# EAGLE design MySens-easyESP32-012 (EAGLE 9.0.1)
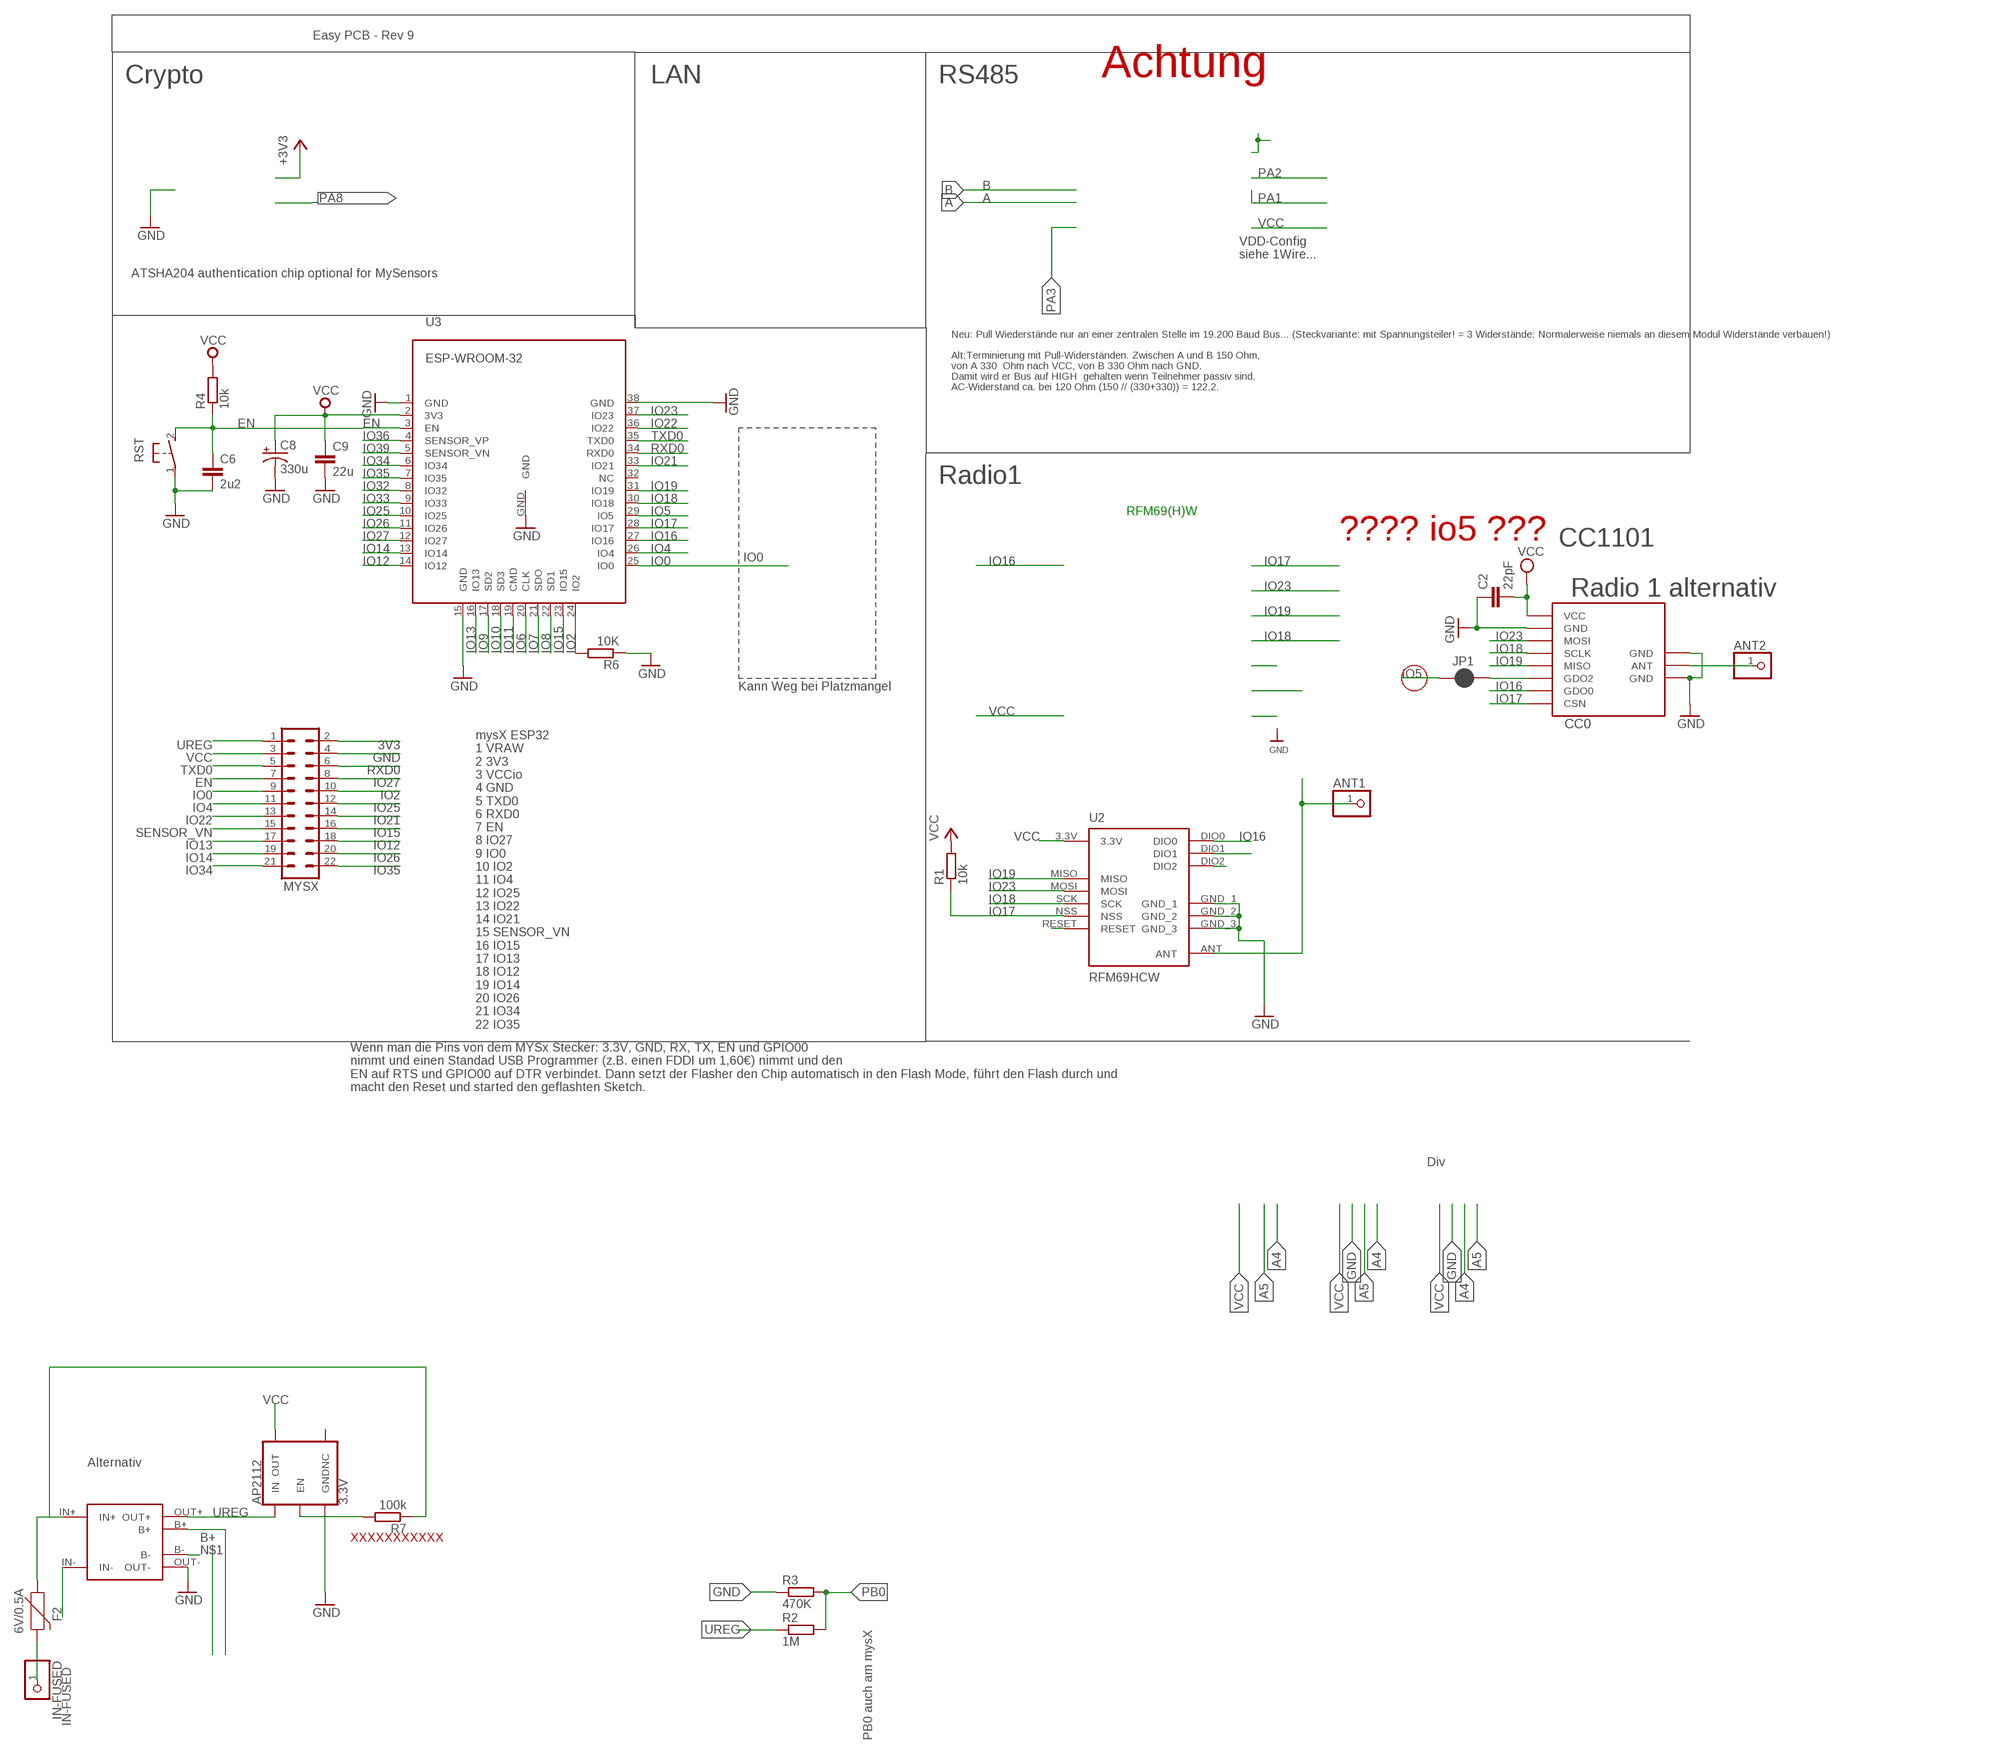
[diagram p0: schematic, sheet 1]

## Parts
ANT1  PINHD-1X1  [1X01]
ANT2  PINHD-1X1  [1X01]
AP2112  3.3V  V_REG_AP2112K-3.3V  [SOT23-5]
C2  22pF  C-EUC0805  [C0805]
C6  2u2  C-EUC0805  [C0805]
C8  330u  CAP_POLSMD  [VISHAY_C]
C9  22u  C-EUC0805  [C0805]
CC0  CC1101  CC1101_MODULE1SMD  [CC1101_MODULE1_SMD]
F2  6V/0.5A  PPTC_HALF-AMP  [1206]
IN-FUSED  PINHD-1X1  [1X01]
JP1  JUMPER-SMT_2_NC_PASTE_NO-SILK  [SMT-JUMPER_2_NC_PASTE_NO-SILK]
MYSX  MA11-2  [MA11-2]
R1  10k  R-EU_M0805  [M0805]
R2  1M  R-EU_M0805  [M0805]
R3  470K  R-EU_M0805  [M0805]
R4  10k  R-EU_M0805  [M0805]
R6  10K  R-EU_M0805  [M0805]
R7  100k  R-EU_M0805  [M0805]
RST  DTSM-3  [DTSM-3]
TP4056  TP4056-MODULE  [TP4056-LITHIUM-PROTECTED-MODULE]
U2  RFM69HCW  [RFM69HCW-XXXS2]
U3  ESP-WROOM-32  [ESP-WROOM-32]

## Nets
3V3: MYSX.2 ; supply symbol labelled +3V3
ANT0: ANT2.1 CC0.ANT
ANT1: ANT1.1 U2.ANT
B+ [vcc]: TP4056.B+
EN: C6.1 MYSX.7 R4.1 RST.2 U3.3(EN)
GND [gnd]: AP2112.2(GND) C2.1 C6.2 C8.- C9.2 CC0.GND@0(GND) CC0.GND@1(GND) CC0.GND@2(GND) MYSX.4 R3.1 R6.1 RST.1 TP4056.OUT- U2.GND_1 U2.GND_2 U2.GND_3 U3.1(GND) U3.15(GND) U3.38(GND) U3.GND
IN++ [vcc]: F2.1 R7.1 TP4056.IN+
IN- [gnd]: TP4056.IN-
IN-FUSED: F2.2 IN-FUSED.1
IO0: MYSX.9 U3.25(IO0)
IO2: MYSX.10 R6.2 U3.24(IO2)
IO4: MYSX.11 U3.26(IO4)
IO5: JP1.1 U3.29(IO5)
IO6: U3.20(CLK)
IO7: U3.21(SDO)
IO8: U3.22(SD1)
IO9: U3.17(SD2)
IO10: U3.18(SD3)
IO11: U3.19(CMD)
IO12: MYSX.18 U3.14(IO12)
IO13: MYSX.17 U3.16(IO13)
IO14: MYSX.19 U3.13(IO14)
IO15: MYSX.16 U3.23(IO15)
IO16: CC0.GDO0 U2.DIO0 U3.27(IO16)
IO17: CC0.CSN R1.1 U2.NSS U3.28(IO17)
IO18: CC0.SCLK U2.SCK U3.30(IO18)
IO19: CC0.MISO U2.MISO U3.31(IO19)
IO21: MYSX.14 U3.33(IO21)
IO22: MYSX.13 U3.36(IO22)
IO23: CC0.MOSI U2.MOSI U3.37(IO23)
IO25: MYSX.12 U3.10(IO25)
IO26: MYSX.20 U3.11(IO26)
IO27: MYSX.8 U3.12(IO27)
IO32: U3.8(IO32)
IO33: U3.9(IO33)
IO34: MYSX.21 U3.6(IO34)
IO35: MYSX.22 U3.7(IO35)
IO36: U3.4(SENSOR_VP)
IO39: U3.5(SENSOR_VN)
MAYBE_IO5: CC0.GDO2 JP1.2
N$1 [gnd]: TP4056.B-
N$4: U2.DIO2
N$8: U2.DIO1
N$9: U2.RESET
N$12: AP2112.3(EN) R7.2
PB0: R2.2 R3.2
RXD0: MYSX.6 U3.34(RXD0)
SENSOR_VN: MYSX.15
TXD0: MYSX.5 U3.35(TXD0)
UREG [gnd]: AP2112.1(IN) MYSX.1 R2.1 TP4056.OUT+
VCC [gnd]: AP2112.5(OUT) C2.2 C8.+ C9.1 CC0.VCC MYSX.3 R1.2 R4.2 U2.3.3V U3.2(3V3)
Unconnected: AP2112.4(NC) U3.32(NC)

## Notes on the sheet
- Easy PCB - Rev 9
- Crypto | LAN | RS485 | Achtung
- VDD-Config
  siehe 1Wire...
- ATSHA204 authentication chip optional for MySensors
- Neu: Pull Wiederstände nur an einer zentralen Stelle im 19.200 Baud Bus... (Steckvariante: mit Spannungsteiler! = 3 Widerstände; Normalerweise niemals an diesem Modul Widerstände verbauen!)
  
  Alt:Terminierung mit Pull-Widerständen. Zwischen A und B 150 Ohm,
  von A 330  Ohm nach VCC, von B 330 Ohm nach GND. 
  Damit wird er Bus auf HIGH  gehalten wenn Teilnehmer passiv sind.
  AC-Widerstand ca. bei 120 Ohm (150 // (330+330)) = 122,2.
- Radio1
- RFM69(H)W
- ???? io5 ??? | CC1101
- Radio 1 alternativ
- Kann Weg bei Platzmangel
- mysX ESP32
  1 VRAW
  2 3V3
  3 VCCio
  4 GND
  5 TXD0
  6 RXD0
  7 EN
  8 IO27
  9 IO0
  10 IO2
  11 IO4
  12 IO25
  13 IO22
  14 IO21
  15 SENSOR_VN
  16 IO15
  17 IO13
  18 IO12
  19 IO14
  20 IO26
  21 IO34
  22 IO35
- Wenn man die Pins von dem MYSx Stecker: 3.3V, GND, RX, TX, EN und GPIO00
  nimmt und einen Standad USB Programmer (z.B. einen FDDI um 1,60€) nimmt und den
  EN auf RTS und GPIO00 auf DTR verbindet. Dann setzt der Flasher den Chip automatisch in den Flash Mode, führt den Flash durch und
  macht den Reset und started den geflashten Sketch.
- Div
- Alternativ
- XXXXXXXXXXX
- PB0 auch am mysX

## Library data of the parts
ANT1 ANT2 IN-FUSED = pinhead:PINHD-1X1: PIN HEADER
AP2112 = SparkFun-IC-Power:V_REG_AP2112: AP2112 - 600mA CMOS LDO Regulator w/ Enable The AP2112 is CMOS process low dropout linear regulator with enable function, the regulator delivers a guaranteed 600mA (min.) continuous load current. Features Output Voltage Accuracy: ±1.5% Output Current: 600mA (Min.) Foldback Short Current Protection: 50mA Enable Function to Turn ON/OFF VOUT Low Dropout Voltage (3.3V): 250mV (Typ.) @IOUT=600mA Excellent Load Regulation: 0.2%/A (Typ.) Excellent Line Regulation: 0.02%/V (Typ.) Low Quiescent Current: 55μA (Typ.) Low Standby Current: 0.01μA (Typ.) Low Output Noise: 50μVRMS PSRR: 100Hz -65dB, 1kHz -65dB OTSD Protection Stable with 1.0μF Flexible Cap: Ceramic, Tantalum and Aluminum Electrolytic Operation Temperature Range: -40°C to 85°C ESD: MM 400V, HBM 4000V; PROD_ID: VREG-12457
C2 = rcl:C-EU: CAPACITOR, European symbol
C6 C9 = rcl@1:C-EU: CAPACITOR, European symbol; SPICEPREFIX: C
C8 = SparkFun-Passives:CAP_POL: Capacitor Polarized These are standard SMD and PTH capacitors. Normally 10uF, 47uF, and 100uF in electrolytic and tantalum varieties. Always verify the external diameter of the through hole cap, it varies with capacity, voltage, and manufacturer. The EIA devices should be standard.
CC0 = wireless:CC1101_MODULE1: CC1101 wireless module for 433/868 MHz (sold from Aliexpress). DIL version for mounting with pin header (and SMD soldering) and SMD only variant available.
F2 = SparkFun-Fuses:PPTC: Resettable Fuse PPTC Resettable Fuse. Really a sort of resistor with a polymeric positive temperature coefficient whose resistance increases dramatically with an increase in temperature. When heated by the power passing through the resistance rises causing the current to be limited, protecting the circuit. This is achieved by the transition of the polymer from a crystalline to an amorphous state where the conductive carbon separates breaking the conductive pathways found in the cool crystalline structure. When a PPTC cools back down it resumes conducting letting the circuit turn back on. SparkFun Products: SparkFun RedBoard - Programmed with Arduino <https://www.sparkfun.com/products/12757> Pro Micro - 5V/16MHz <https://www.sparkfun.com/products/12640> Arduino Pro 328 - 5V/16MHz <https://www.sparkfun.com/products/10915> MP3 Trigger <https://www.sparkfun.com/products/13720>; PROD_ID: RES-08585
JP1 = SparkFun-Jumpers:JUMPER-SMT_2_NC_PASTE: Normally closed solder jumper This jumper has an aperture in the stencil to allow solder paste to bridge the split in the wire so it's normally closed (NC). Wick off the solder to open the connection. Reapply solder to reclose the connection.
MYSX = con-Pinheader:MA11-2: PIN HEADER; OC_FARNELL: unknown; OC_NEWARK: unknown
R1-R3 R6 R7 = rcl:R-EU_: RESISTOR, European symbol
R4 = rcl@1:R-EU_: RESISTOR, European symbol; SPICEPREFIX: R
RST = switch-tact:DTSM-3
TP4056 = tp2112-usw:TP4056-MODULE
U2 = doug:RFM69H
U3 = esp32:ESP-WROOM-32

## Net classes
0 default: width 0.305 mm, clearance 0.205 mm
1 gnd: width 0.457 mm, drill 0.635 mm, clearance 0.254 mm
2 vcc: width 0.406 mm, drill 0.406 mm, clearance 0.254 mm

## Board
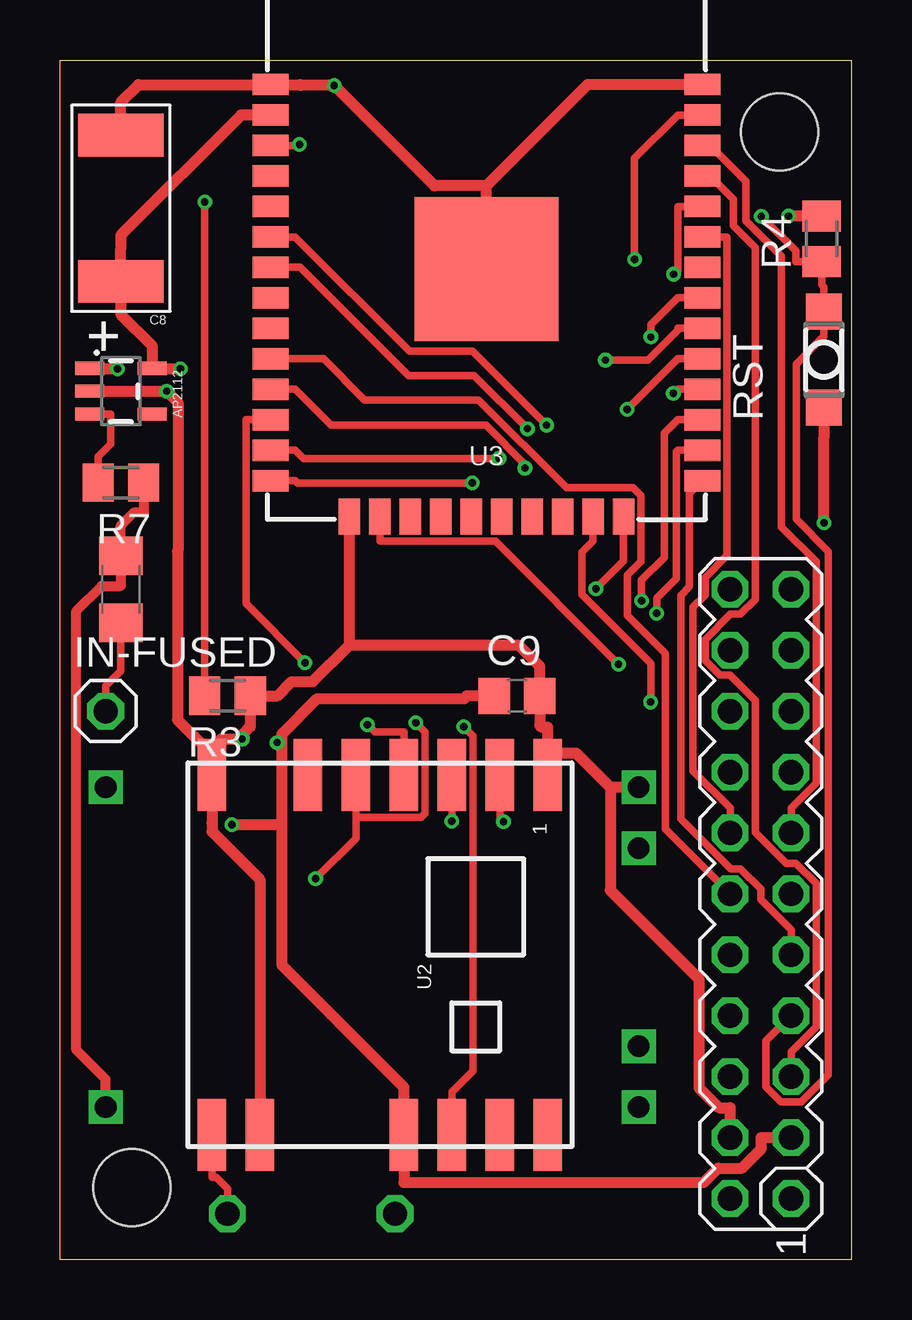
[diagram p1: board, top side]
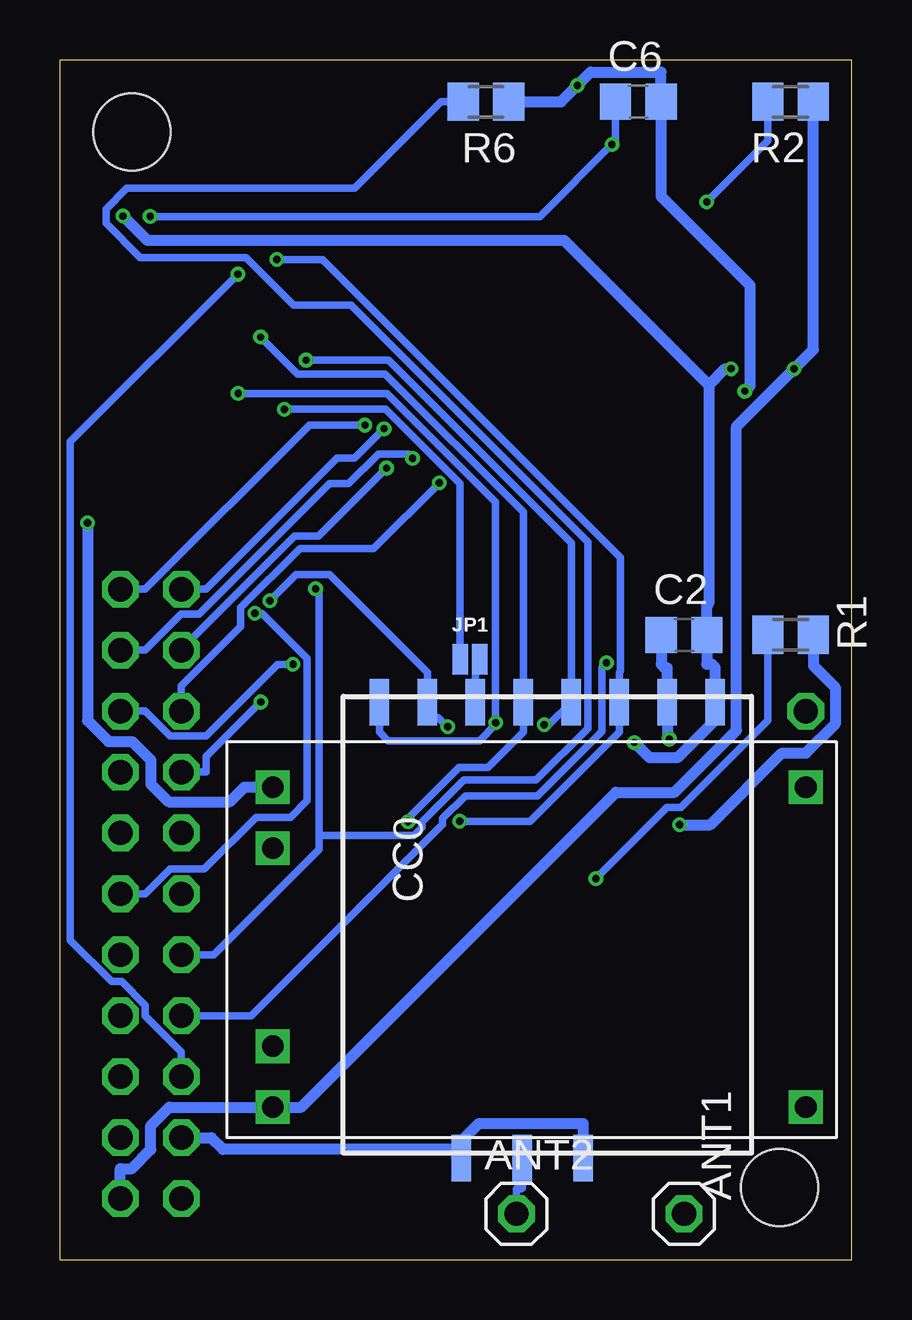
[diagram p2: board, bottom side, seen from below]

Size 33 x 50 mm. Coordinates in mm from the lower left corner, seen from the top.
Outline: 0,0 0,50 33,50 33,0 0,0
Copper layers (1*16): Top 0.035mm / dielectric 1.5mm / Bottom 0.035mm
Design rules "dirt_cheap_dirty_boards.v1": minimum track width 5mil, minimum drill 12mil, track to track 5mil, track to pad 5mil, pad to pad 5mil, via to via 5mil, smd to smd 0mil, copper to edge 10mil, drill to drill 10mil, minimum pad ring 10mil, minimum via ring 6mil, stop-mask expansion 2mil, vias tented up to drill 25mil, thermal gap 10mil
Holes 3.2 mm at 3,3 30,47

### Footprints (pad centres in the part's own frame; a part is rotated, then mirrored left to right if it is on the bottom)
1X01 = drill 1.016 octagon: 1 0,0
SOT23-5 = smd 0.55 x 1.2: 1 -0.95,-1.3; 2 0,-1.3; 3 0.95,-1.3; 4 0.95,1.3; 5 -0.95,1.3
C0805 = smd 1.3 x 1.5: 1 -0.95,0; 2 0.95,0
VISHAY_C = smd 3.556 x 1.778: + 0,3.048; - 0,-3.048
CC1101_MODULE1_SMD = smd 1.93 x 0.813: ANT 19,5.96; CSN 0,0; GDO0 0,2; GDO2 0,4; GND@0 0,12; GND@1 19,8.5; GND@2 19,3.42; MISO 0,6; MOSI 0,10; SCLK 0,8; VCC 0,14
1206 = smd 1.6 x 1.8: 1 -1.4,0; 2 1.4,0
SMT-JUMPER_2_NC_PASTE_NO-SILK = smd 0.635 x 1.27: 1 -0.406,0; 2 0.406,0
MA11-2 = drill 1.016 octagon: 1 -12.7,-1.27; 2 -12.7,1.27; 3 -10.16,-1.27; 4 -10.16,1.27; 5 -7.62,-1.27; 6 -7.62,1.27; 7 -5.08,-1.27; 8 -5.08,1.27; 9 -2.54,-1.27; 10 -2.54,1.27; 11 0,-1.27; 12 0,1.27; 13 2.54,-1.27; 14 2.54,1.27; 15 5.08,-1.27; 16 5.08,1.27; 17 7.62,-1.27; 18 7.62,1.27; 19 10.16,-1.27; 20 10.16,1.27; 21 12.7,-1.27; 22 12.7,1.27
M0805 = smd 1.3 x 1.6: 1 -0.95,0; 2 0.95,0
DTSM-3 = smd 1.5 x 1.5: 1 -2,0; 2 2,0
TP4056-LITHIUM-PROTECTED-MODULE = drill 0.9 square: B+ 10.795,4.445; B- 10.795,-3.81; IN+ -11.43,6.985; IN- -11.43,-6.35; OUT+ 10.795,6.985; OUT- 10.795,-6.35
RFM69HCW-XXXS2 = smd 3 x 1.2: 3.3V 7.5,1; ANT 7.5,-7; DIO0 7.5,3; DIO1 7.5,5; DIO2 7.5,7; GND_1 7.5,-5; GND_2 -7.5,-7; GND_3 -7.5,7; MISO -7.5,5; MOSI -7.5,3; NSS -7.5,-1; RESET -7.5,-3; SCK -7.5,1
ESP-WROOM-32 = smd 0.9 x 1.5: 1 7.7,9; 2 6.43,9; 3 5.16,9; 4 3.89,9; 5 2.62,9; 6 1.35,9; 7 0.08,9; 8 -1.19,9; 9 -2.46,9; 10 -3.73,9; 11 -5,9; 12 -6.27,9; 13 -7.54,9; 14 -8.81,9; 25 -8.81,-9; 26 -7.54,-9; 27 -6.27,-9; 28 -5,-9; 29 -3.73,-9; 30 -2.46,-9; 31 -1.19,-9; 32 0.08,-9; 33 1.35,-9; 34 2.62,-9; 35 3.89,-9; 36 5.16,-9; 37 6.43,-9; 38 7.7,-9 | smd 1.5 x 0.9: 15 -10.3,5.715; 16 -10.3,4.445; 17 -10.3,3.175; 18 -10.3,1.905; 19 -10.3,0.635; 20 -10.3,-0.635; 21 -10.3,-1.905; 22 -10.3,-3.175; 23 -10.3,-4.445; 24 -10.3,-5.715 | smd 6 x 6: GND 0,0

### Placement (x,y rotation side)
ANT1  6.99,1.91 0 bottom
ANT2  13.97,1.91 0 bottom
AP2112  2.54,36.2 270 top
C2  6.99,26.04 0 bottom
C6  8.89,48.26 0 bottom
C8  2.54,43.81 180 top
C9  19.05,23.5 0 top
CC0  19.68,23.23 270 bottom
F2  2.54,27.94 270 top
IN-FUSED  1.91,22.86 0 top
JP1  15.91,25.02 0 bottom
MYSX  29.21,15.24 90 top
R1  2.54,26.04 0 bottom
R2  2.54,48.26 180 bottom
R3  6.99,23.5 180 top
R4  31.75,42.55 90 top
R6  15.24,48.26 180 bottom
R7  2.54,32.38 180 top
RST  31.84,37.51 90 top
TP4056  13.34,13.34 180 bottom
U2  13.34,12.7 270 top
U3  17.78,41.27 90 top

### Tracks (layer width: path | path; a pad name or v marks a point on that pad's centre or on a via)
ANT0
  Bottom 0.305: ANT2.1 13.97,2.95 13.76,2.95 13.72,2.98 CC0.ANT
ANT1
  Top 0.305: U2.ANT 6.33,3.42 6.51,3.42 6.99,2.95 ANT1.1
EN  (via drill 0.3 pad 0.61)
  Top 0.305: v29.24,43.48 30.67,42.05 30.67,41.59 R4.1 31.75,40.63 31.84,40.54 31.84,40.02 RST.2 31.84,38.48 30.69,37.32 30.69,30.86 32.04,29.52 32.04,7.7 30.91,6.57 30.05,6.57 29.44,7.19 29.44,9.12 MYSX.7 | U3.3 9.94,46.44 v9.99,46.48
  Bottom 0.305: v29.24,43.48 12.99,43.48 v9.99,46.48 9.84,46.63 C6.1
GND  (via drill 0.3 pad 0.61)
  Top 0.457: U3.38 22,48.98 17.78,44.76 | U3.GND 17.78,44.76 | 17.78,44.76 15.61,44.76 v11.43,48.94 10.05,48.94 10.01,48.98 U3.1 3.28,48.98 2.54,48.23 C8.- | U2.GND_1 8.34,15.84 6.33,17.84 6.33,18.22 U2.GND_2 6.33,20.41 6.33,21.3 | 12.06,25.61 U3.15 | 12.06,25.61 10.54,24.09 9.66,24.09 9.07,23.5 R3.1 7.93,22.21 7.59,21.87 v7.59,21.7 6.74,21.7 6.33,21.3 | 12.06,25.61 19.12,25.61 20,24.73 C9.2 20,22.26 20.08,22.18 20.34,22.18 20.34,21.11 | MYSX.4 27.94,6.33 27.47,6.33 26.64,7.15 26.64,11.69 22.94,15.39 22.94,19.68 | 22.94,19.68 23.12,19.68 TP4056.OUT- | 20.34,21.11 21.52,21.11 22.94,19.68 | U2.GND_3 20.34,21.11 | 6.33,21.3 6.1,21.3 4.9,22.5 4.9,29.52 4.92,29.55 4.92,35.72 v4.45,36.2 2.32,36.2 AP2112.2 | RST.1 31.84,34.28 31.85,34.27 v31.85,30.7
  Bottom 0.457: v31.85,30.7 31.85,22.47 30.98,21.59 29.98,21.59 29.21,20.82 29.21,19.82 28.46,19.07 25.93,19.07 25.32,19.68 TP4056.OUT- | v7.59,21.7 7.61,21.7 7.68,21.78 CC0.GND@0 7.68,24.67 7.8,24.67 7.93,24.8 C2.1 | v4.45,36.2 4.23,36.41 4.23,40.61 7.94,44.31 C6.2 7.94,49.49 10.88,49.49 v11.43,48.94 12.11,48.26 13.72,48.26 R6.1 | MYSX.4 26.7,5.08 26.2,4.59 16.27,4.59 | 16.27,4.59 16.27,4.95 15.54,5.67 11.19,5.67 CC0.GND@1 | CC0.GND@2 16.27,4.59
IN++
  Top 0.406: TP4056.IN+ 1.91,7.51 0.68,8.73 0.68,27.03 1.74,28.08 2.54,28.08 F2.1 2.54,30.6 3.07,31.13 3.49,31.13 R7.1
IN-FUSED
  Top 0.305: IN-FUSED.1 1.91,23.9 2.54,24.54 F2.2
IO0
  Top 0.305: U3.25 26.24,31.92 26.24,28.05 25.88,27.69 25.88,18.36 27.96,16.28 28.37,16.28 29.21,15.44 29.21,15.01 30.48,13.74 MYSX.9
IO2  (via drill 0.3 pad 0.61)
  Top 0.305: v22.34,27.96 23.5,29.11 23.5,29.95 U3.24
  Bottom 0.305: 22.19,17.67 18.24,17.67 17.9,18.01 17.9,18.25 16.16,19.99 13.15,19.99 11,22.14 11,29.9 20.87,39.78 23.25,39.78 25.23,41.76 29.65,41.76 31.08,43.19 31.08,43.79 30.22,44.65 20.73,44.65 17.12,48.26 R6.2 | v22.34,27.96 22.19,27.81 22.19,17.67 | 22.19,17.67 22.19,17.09 26.59,12.7 MYSX.10
IO4  (via drill 0.3 pad 0.61)
  Top 0.305: v24.88,26.93 24.88,27.57 25.7,28.39 25.7,33.68 25.75,33.73 U3.26
  Bottom 0.305: v24.88,26.93 24.58,26.93 22.7,25.05 22.7,19.12 23.39,18.43 24.83,18.43 26.98,16.28 28.4,16.28 29.44,15.24 MYSX.11
IO5  (via drill 0.3 pad 0.61)
  Top 0.305: v23.65,35.44 25.75,37.55 U3.29
  Bottom 0.305: JP1.1 16.32,32.34 19.42,35.44 v23.65,35.44
IO12  (via drill 0.3 pad 0.61)
  Top 0.305: U3.14 9.81,32.47 9.9,32.37 v17.19,32.37
  Bottom 0.305: v17.19,32.37 19.92,29.64 23,29.64 25.46,27.18 25.46,26.38 27.94,23.9 MYSX.18
IO13  (via drill 0.3 pad 0.61)
  Top 0.305: v23.29,24.81 18.15,29.95 13.34,29.95 U3.16
  Bottom 0.305: v23.29,24.81 23.92,24.81 26.91,21.82 28.4,21.82 29.44,22.86 MYSX.17
IO14  (via drill 0.3 pad 0.61)
  Top 0.305: v18.3,33.39 10.15,33.39 9.81,33.73 U3.13
  Bottom 0.305: v18.3,33.39 18.49,33.58 19.72,33.58 20.96,32.33 21.75,32.33 27.19,26.9 27.94,26.9 29.44,25.4 MYSX.19
IO15  (via drill 0.3 pad 0.61)
  Top 0.305: v24.63,23.24 24.63,24.85 21.76,27.72 21.76,29.48 22.23,29.95 U3.23
  Bottom 0.305: MYSX.16 26.9,20.32 26.9,20.97 v24.63,23.24
IO16  (via drill 0.3 pad 0.61)
  Top 0.305: v24.25,27.46 24.25,28.32 25.19,29.26 25.19,34.44 25.75,35.01 U3.27 | v16.84,22.2 17.21,21.83 17.21,7.86 16.34,6.98 U2.DIO0
  Bottom 0.305: v24.25,27.46 23.16,28.54 21.76,28.54 17.68,24.47 CC0.GDO0 17.68,22.6 17.23,22.6 v16.84,22.2
IO17  (via drill 0.3 pad 0.61)
  Top 0.305: v25.57,36.1 25.75,36.27 U3.28 | v10.65,15.88 12.34,17.56 12.34,18.42 | 12.34,18.42 15.05,18.42 15.21,18.58 15.21,22 v14.84,22.37 | 12.34,18.42 U2.NSS
  Bottom 0.305: v25.57,36.1 19.36,36.1 14.84,31.58 v14.84,22.37 14.84,22.29 15.51,21.62 19.32,21.62 19.68,21.98 CC0.CSN | R1.1 3.49,22.46 7.12,18.84 7.7,18.84 v10.65,15.88
IO18  (via drill 0.3 pad 0.61)
  Top 0.305: v22.74,37.49 24.5,37.49 25.75,38.74 25.75,38.81 U3.30 | U2.SCK 14.34,21.98 13.13,21.98 v12.81,22.3
  Bottom 0.305: v22.74,37.49 19.3,37.49 11.69,29.87 CC0.SCLK 12.62,22.3 v12.81,22.3
IO19  (via drill 0.3 pad 0.61)
  Top 0.305: U3.31 25.75,40.09 24.63,38.97 v24.63,38.45 | v18.49,18.26 18.34,18.41 18.34,18.42 U2.MISO
  Bottom 0.305: v24.63,38.45 23.09,36.9 19.44,36.9 13.69,31.15 13.69,24.47 CC0.MISO 13.69,21.98 15.16,20.5 16.37,20.5 18.49,18.39 v18.49,18.26
IO21
  Top 0.305: U3.33 27.81,42.62 27.81,29.34 26.9,28.43 26.9,27.71 26.39,27.2 26.39,20.37 27.94,18.82 MYSX.14
IO22
  Top 0.305: U3.36 27.11,46.44 28.59,44.95 28.59,43.3 30.07,41.82 30.07,30.54 31.52,29.09 31.52,19.86 30.48,18.82 MYSX.13
IO23  (via drill 0.3 pad 0.61)
  Top 0.305: U3.37 25.75,47.7 23.96,45.91 v23.96,41.69 | v16.34,18.27 16.34,18.42 U2.MOSI
  Bottom 0.305: v23.96,41.69 22.06,41.69 9.63,29.26 9.63,24.52 9.69,24.47 CC0.MOSI 9.69,21.98 13.4,18.27 v16.34,18.27
IO25
  Top 0.305: U3.10 10.99,37.55 12.71,35.83 17.45,35.83 21.1,32.18 23.89,32.18 24.23,31.84 24.23,29.1 23.66,28.54 23.66,26.84 25.24,25.26 25.24,17.94 MYSX.12
IO26  (via drill 0.3 pad 0.61)
  Top 0.305: v19.39,32.99 19.39,33.14 17.75,34.77 11.31,34.77 9.81,36.27 U3.11
  Bottom 0.305: MYSX.20 27.94,25.43 23.22,30.15 22.22,30.15 v19.39,32.99
IO27  (via drill 0.3 pad 0.61)
  Top 0.305: U3.12 7.75,35.01 7.75,27.34 v10.21,24.87
  Bottom 0.305: v10.21,24.87 10.41,24.68 10.41,22.02 13.09,19.33 16.1,19.33 17.06,18.38 17.06,18.13 25.03,10.16 MYSX.8
IO34  (via drill 0.3 pad 0.61)
  Top 0.305: v20.29,34.78 17.2,37.87 14.57,37.87 9.81,42.62 U3.6
  Bottom 0.305: v20.29,34.78 22.59,34.78 29.44,27.94 MYSX.21
IO35  (via drill 0.3 pad 0.61)
  Top 0.305: U3.7 10.02,41.35 14.52,36.85 17.27,36.85 v19.49,34.63
  Bottom 0.305: v19.49,34.63 20.72,33.4 21.44,33.4 26.9,27.94 MYSX.22
MAYBE_IO5
  Bottom 0.305: CC0.GDO2 15.69,24.47 15.5,24.65 JP1.2
N$12
  Top 0.305: AP2112.3 2.12,35.24 2.12,33.99 1.59,33.46 R7.2
PB0  (via drill 0.3 pad 0.61)
  Top 0.305: v6.04,44.08 6.04,24.57 R3.2
  Bottom 0.305: R2.2 3.49,46.63 v6.04,44.08
RXD0  (via drill 0.3 pad 0.61)
  Top 0.305: v25.58,41.07 25.75,41.24 25.75,43.9 U3.34
  Bottom 0.305: v25.58,41.07 32.57,34.09 32.57,13.31 30.85,11.59 30.43,11.59 29.44,10.59 29.44,10.16 27.94,8.66 MYSX.6
TXD0
  Top 0.305: U3.35 27.11,45.16 28.08,44.19 28.08,43.09 28.98,42.19 28.98,27.51 28.37,26.9 27.95,26.9 26.9,25.84 26.9,24.97 27.51,24.36 27.93,24.36 28.98,23.3 28.98,17.8 30.27,16.51 30.68,16.51 31.53,15.67 31.53,9.71 30.48,8.66 MYSX.5
UREG  (via drill 0.3 pad 0.61)
  Top 0.457: AP2112.1 2.32,37.15 2.35,37.12 v2.4,37.12
  Bottom 0.457: MYSX.1 30.48,3.79 30.01,3.79 29.21,4.58 29.21,5.58 28.44,6.35 TP4056.OUT+ 22.94,6.35 9.82,19.47 7.38,19.47 4.79,22.06 4.79,34.73 v2.4,37.12 1.59,37.93 R2.1
VCC  (via drill 0.3 pad 0.61)
  Top 0.457: 9.25,18.12 9.25,21.55 | 9.25,18.12 9.25,12.27 14.34,7.18 U2.3.3V 14.34,4.21 14.34,3.22 26.84,3.22 27.43,3.81 28.43,3.81 29.23,4.61 29.23,5.08 MYSX.3 | 9.25,18.12 v7.16,18.12 | v9.05,21.55 9.25,21.55 | 9.25,21.55 9.25,21.9 10.72,23.38 16.85,23.38 16.97,23.5 C9.1 | v5.02,37.13 4.93,37.13 4.92,37.15 AP2112.5 3.84,38.09 2.54,39.4 C8.+ 2.54,41.45 2.54,42.14 2.54,42.7 7.55,47.7 U3.2 | R4.2 30.47,43.49 30.46,43.49 v30.37,43.49
  Bottom 0.457: R1.2 1.59,24.75 0.66,23.82 0.66,22.35 1.9,21.11 2.9,21.11 5.89,18.12 v7.16,18.12 | 5.95,36.46 5.95,27.35 6.04,27.27 C2.2 6.04,24.8 5.82,24.8 5.68,24.67 5.68,23.95 CC0.VCC 5.68,22.49 7.27,20.91 8.41,20.91 v9.05,21.55 | 5.95,36.46 11.97,42.48 29.35,42.48 v30.37,43.49 | 5.95,36.46 5.28,37.13 v5.02,37.13

### Text on the board
tNames: easyGW BluePill 0.2 / RS485, RFM69, RFM95 | VCC | GND | SDL | SDA | 5V | UREG | GND | 5V
bNames: PluepillGW V01 / RS485, RFM69, RFM95
Document: DS_1551K